# EAGLE schematic sim900min11 (EAGLE 6.2)
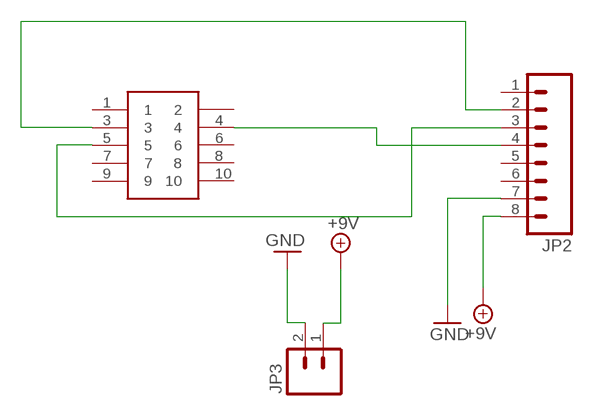
[diagram p0: schematic, sheet 1]

## Parts
JP2  M081X08  [1X08]
JP3  M02JST-PTH-2-KIT  [JST-2-PTH-KIT]
U$1  SHF105SM  [SHF105DSM]

## Nets
+9V: JP2.8 JP3.1
GND: JP2.7 JP3.2
PWR: JP2.2 U$1.3
RX: JP2.3 U$1.5
TX: JP2.4 U$1.4
Unconnected: JP2.1 JP2.5 JP2.6 U$1.1 U$1.2 U$1.6 U$1.7 U$1.8 U$1.9 U$1.10

## Library data of the parts
JP2 = SparkFun-Connectors:M08: Header 8 Standard 8-pin 0.1" header. Use with straight break away headers (SKU : PRT-00116), right angle break away headers (PRT-00553), swiss pins (PRT-00743), machine pins (PRT-00117), and female headers (PRT-00115).
JP3 = SparkFun-Connectors:M02: Header 2 Standard 2-pin 0.1" header. Use with straight break away headers (SKU : PRT-00116), right angle break away headers (PRT-00553), swiss pins (PRT-00743), machine pins (PRT-00117), and female headers (PRT-00115). Molex polarized connector foot print use with SKU : PRT-08233 with associated crimp pins and housings.
U$1 = ozlollc:SHF105